# EAGLE design Lab (EAGLE 6.5.0)

## Sheet 1 of 2
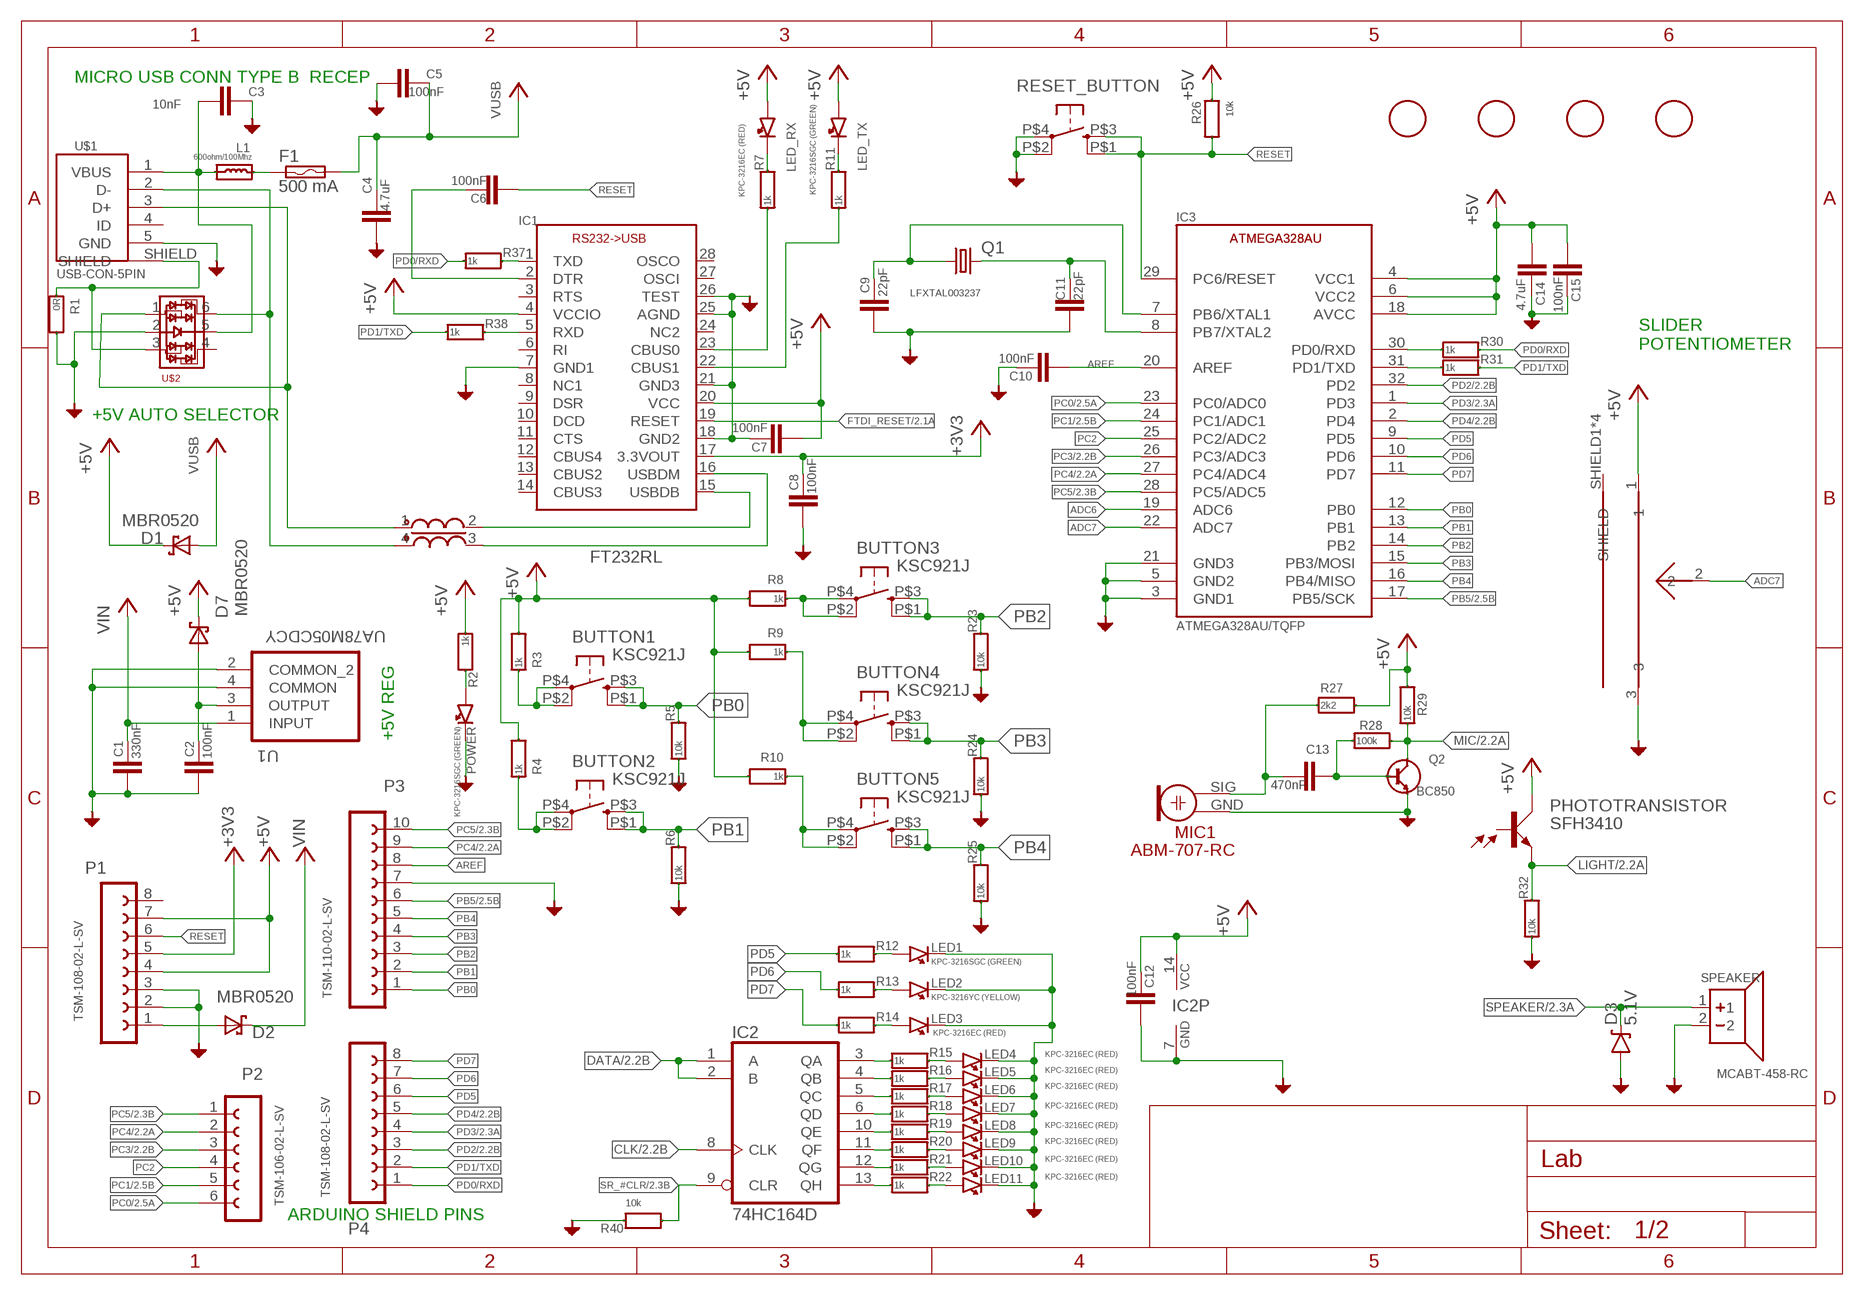
[diagram p0: schematic, sheet 1]

### Parts
BUTTON1  KSC921J  [TACT_SWITCH_4_PIN]
BUTTON2  KSC921J  [TACT_SWITCH_4_PIN]
BUTTON3  KSC921J  [TACT_SWITCH_4_PIN]
BUTTON4  KSC921J  [TACT_SWITCH_4_PIN]
BUTTON5  KSC921J  [TACT_SWITCH_4_PIN]
C1  330nF  C-EUC0805  [C0805]
C2  100nF  C-EUC0805  [C0805]
C3  10nF  C-EUC0805  [C0805]
C4  4.7uF  C-EUC0805  [C0805]
C5  100nF  C-EUC0805  [C0805]
C6  100nF  C-EUC0805  [C0805]
C7  100nF  C-EUC0805  [C0805]
C8  100nF  C-EUC0805  [C0805]
C9  22pF  C-EUC0805  [C0805]
C10  100nF  C-EUC0805  [C0805]
C11  22pF  C-EUC0805  [C0805]
C12  100nF  C-EUC0805  [C0805]
C13  470nF  C-EUC0805  [C0805]
C14  4.7uF  C-EUC0805  [C0805]
C15  100nF  C-EUC0805  [C0805]
D1  MBR0520  [SOD123]
D2  MBR0520  [SOD123]
D3  5.1V  DIODE-ZENER5.6V  [SOD-323]
D7  MBR0520  [SOD123]
F1  500 mA  POLYSWITCH  [PT1206]
IC1  FT232RL  [SSOP28]
IC2  74HC164D  [SO14]
IC3  ATMEGA328AU/TQFP  ATMEGA328AU  [TQFP32-08]
L1  600ohm/100Mhz  INDUCTOR_0603_600R  [R0603]
LED1  KPC-3216SGC (GREEN)  SMDLED_3216  [LED3216_PAC]
LED2  KPC-3216YC (YELLOW)  SMDLED_3216  [LED3216_PAC]
LED3  KPC-3216EC (RED)  SMDLED_3216  [LED3216_PAC]
LED4  KPC-3216EC (RED)  SMDLED_3216  [LED3216_PAC]
LED5  KPC-3216EC (RED)  SMDLED_3216  [LED3216_PAC]
LED6  KPC-3216EC (RED)  SMDLED_3216  [LED3216_PAC]
LED7  KPC-3216EC (RED)  SMDLED_3216  [LED3216_PAC]
LED8  KPC-3216EC (RED)  SMDLED_3216  [LED3216_PAC]
LED9  KPC-3216EC (RED)  SMDLED_3216  [LED3216_PAC]
LED10  KPC-3216EC (RED)  SMDLED_3216  [LED3216_PAC]
LED11  KPC-3216EC (RED)  SMDLED_3216  [LED3216_PAC]
LED_RX  KPC-3216EC (RED)  SMDLED_3216  [LED3216_PAC]
LED_TX  KPC-3216SGC (GREEN)  SMDLED_3216  [LED3216_PAC]
MIC1  ABM-707-RC  [ABM-707-RC]
P1  TSM-108-02-L-SV  FE08-1  [FE08]
P2  TSM-106-02-L-SV  FE06-1  [FE06]
P3  TSM-110-02-L-SV  FE10-1  [FE10]
P4  TSM-108-02-L-SV  FE08-1  [FE08]
PHOTOTRANSISTOR  SFH3410SMD  [SFH3410]
POWER  KPC-3216SGC (GREEN)  SMDLED_3216  [LED3216_PAC]
Q1  LFXTAL003237  CRYSTALSM49  [SM49]
Q2  BC850  [MY_SOT23]
R1  0R  MYRES_0805  [R0805]
R2  1k  MYRES_0805  [R0805]
R3  1k  MYRES_0805  [R0805]
R4  1k  MYRES_0805  [R0805]
R5  10k  MYRES_0805  [R0805]
R6  10k  MYRES_0805  [R0805]
R7  1k  MYRES_0805  [R0805]
R8  1k  MYRES_0805  [R0805]
R9  1k  MYRES_0805  [R0805]
R10  1k  MYRES_0805  [R0805]
R11  1k  MYRES_0805  [R0805]
R12  1k  MYRES_0805  [R0805]
R13  1k  MYRES_0805  [R0805]
R14  1k  MYRES_0805  [R0805]
R15  1k  MYRES_0805  [R0805]
R16  1k  MYRES_0805  [R0805]
R17  1k  MYRES_0805  [R0805]
R18  1k  MYRES_0805  [R0805]
R19  1k  MYRES_0805  [R0805]
R20  1k  MYRES_0805  [R0805]
R21  1k  MYRES_0805  [R0805]
R22  1k  MYRES_0805  [R0805]
R23  10k  MYRES_0805  [R0805]
R24  10k  MYRES_0805  [R0805]
R25  10k  MYRES_0805  [R0805]
R26  10k  MYRES_0805  [R0805]
R27  2k2  MYRES_0805  [R0805]
R28  100k  MYRES_0805  [R0805]
R29  10k  MYRES_0805  [R0805]
R30  1k  MYRES_0805  [R0805]
R31  1k  MYRES_0805  [R0805]
R32  10k  MYRES_0805  [R0805]
R37  1k  MYRES_0805  [R0805]
R38  1k  MYRES_0805  [R0805]
R40  10k  MYRES_0805  [R0805]
RESET_BUTTON  KSC921J  [TACT_SWITCH_4_PIN]
SLIDER_RESISTOR  PTA4543  [PTA4543]
SPEAKER  MCABT-458-RC  SMD_SPEAKER  [SMD_SPK_PAC]
U1  UA78M05CDCY  [SOT230P700X180-4N]
U$1  USB-CON-5PIN  [USB-MICRO-MOLEX-105017-0001_V2]
U$2  PRTR5V0U4Y  [SOT363]
U$3  FIDUCIAL  [FIDUCIAL_1MM]
U$4  FIDUCIAL  [FIDUCIAL_1MM]
U$5  FIDUCIAL  [FIDUCIAL_1MM]
U$6  FIDUCIAL  [FIDUCIAL_1MM]
USB_FILTER  SRF3216A  [SRF3216A]

### Nets
+3V3: C8.1 IC1.17(3.3VOUT) P1.5
+5V: C7.2 C12.2 C14.2 C15.2 D1.1(K) D7.1(K) IC1.4(VCCIO) IC1.20(VCC) IC2.14(VCC) IC3.4(VCC1) IC3.6(VCC2) IC3.18(AVCC) LED_RX.1 LED_TX.1 P1.4 P1.7 PHOTOTRANSISTOR.COLLECTOR R2.1 R3.2 R4.2 R8.2 R9.2 R10.2 R26.2 R27.2 R29.2 SLIDER_RESISTOR.1 ; also sheet 2
ADC6: IC3.19(ADC6)
ADC7: IC3.22(ADC7) SLIDER_RESISTOR.2
AREF: C10.2 IC3.20(AREF) P3.8
CLK: IC2.8(CLK) ; also sheet 2
DATA: IC2.1(A) IC2.2(B) ; also sheet 2
FTDI_RESET: IC1.19(RESET) ; also sheet 2
GND: C1.2 C2.2 C3.1 C4.2 C5.2 C7.1 C8.2 C9.2 C10.1 C11.2 C12.1 C14.1 C15.1 D3.A IC1.7(GND1) IC1.18(GND2) IC1.21(GND3) IC1.25(AGND) IC1.26(TEST) IC2.7(GND) IC3.3(GND1) IC3.5(GND2) IC3.21(GND3) LED1.2 LED2.2 LED3.2 LED4.2 LED5.2 LED6.2 LED7.2 LED8.2 LED9.2 LED10.2 LED11.2 MIC1.GND P1.2 P1.3 P3.7 POWER.2 Q2.2 R1.2 R5.1 R6.1 R23.1 R24.1 R25.1 R32.1 R40.2 RESET_BUTTON.P$2 RESET_BUTTON.P$4 SLIDER_RESISTOR.3 SPEAKER.2 U1.2(COMMON_2) U1.4(COMMON) U$1.5(GND) U$2.2 ; also sheet 2
LIGHT: PHOTOTRANSISTOR.EMITTER R32.2 ; also sheet 2
MIC: Q2.3 R28.2 R29.1 ; also sheet 2
N$1: C11.1 IC3.8(PB7/XTAL2) Q1.2
N$2: C9.1 IC3.7(PB6/XTAL1) Q1.1
N$3: LED5.1 R16.2
N$4: LED3.1 R14.2
N$6: LED2.1 R13.2
N$7: LED1.1 R12.2
N$8: LED4.1 R15.2
N$9: LED6.1 R17.2
N$10: LED7.1 R18.2
N$11: LED8.1 R19.2
N$12: LED9.1 R20.2
N$13: D2.2(A) P1.1
N$14: LED10.1 R21.2
N$15: IC1.23(CBUS0) R7.1
N$16: C6.1 IC1.2(DTR)
N$17: POWER.1 R2.2
N$18: IC1.15(USBDB) USB_FILTER.2
N$19: IC1.16(USBDM) USB_FILTER.3
N$20: LED11.1 R22.2
N$21: IC3.30(PD0/RXD) R30.1
N$22: IC2.3(QA) R15.1
N$23: IC2.4(QB) R16.1
N$25: IC2.5(QC) R17.1
N$28: LED_RX.2 R7.2
N$29: LED_TX.2 R11.2
N$30: IC1.22(CBUS1) R11.1
N$31: U$1.3(D+) U$2.1 USB_FILTER.1
N$32: IC3.31(PD1/TXD) R31.1
N$35: BUTTON1.P$2 BUTTON1.P$4 R3.1
N$37: BUTTON2.P$2 BUTTON2.P$4 R4.1
N$38: U$1.2(D-) U$2.6 USB_FILTER.4
N$40: BUTTON4.P$2 BUTTON4.P$4 R9.1
N$41: BUTTON5.P$2 BUTTON5.P$4 R10.1
N$42: BUTTON3.P$2 BUTTON3.P$4 R8.1
N$43: F1.1A F1.1B L1.1
N$44: IC1.5(RXD) R38.2
N$45: IC1.1(TXD) R37.2
N$46: C2.1 D7.2(A) U1.3(OUTPUT)
N$52: IC2.6(QD) R18.1
N$56: IC2.10(QE) R19.1
N$57: IC2.11(QF) R20.1
N$58: IC2.12(QG) R21.1
N$59: IC2.13(QH) R22.1
N$78: C13.1 Q2.1 R28.1
N$81: C13.2 MIC1.SIG R27.1
N$83: C3.2 L1.2 U$1.1(VBUS) U$2.5
PB0: BUTTON1.P$1 BUTTON1.P$3 IC3.12(PB0) P3.1 R5.2
PB1: BUTTON2.P$1 BUTTON2.P$3 IC3.13(PB1) P3.2 R6.2
PB2: BUTTON3.P$1 BUTTON3.P$3 IC3.14(PB2) P3.3 R23.2
PB3: BUTTON4.P$1 BUTTON4.P$3 IC3.15(PB3/MOSI) P3.4 R24.2
PB4: BUTTON5.P$1 BUTTON5.P$3 IC3.16(PB4/MISO) P3.5 R25.2
PB5: IC3.17(PB5/SCK) P3.6 ; also sheet 2
PC0: IC3.23(PC0/ADC0) P2.6 ; also sheet 2
PC1: IC3.24(PC1/ADC1) P2.5 ; also sheet 2
PC2: IC3.25(PC2/ADC2) P2.4
PC3: IC3.26(PC3/ADC3) P2.3 ; also sheet 2
PC4: IC3.27(PC4/ADC4) P2.2 P3.9 ; also sheet 2
PC5: IC3.28(PC5/ADC5) P2.1 P3.10 ; also sheet 2
PD0/RXD: P4.1 R30.2 R37.1
PD1/TXD: P4.2 R31.2 R38.1
PD2: IC3.32(PD2) P4.3 ; also sheet 2
PD3: IC3.1(PD3) P4.4 ; also sheet 2
PD4: IC3.2(PD4) P4.5 ; also sheet 2
PD5: IC3.9(PD5) P4.6 R12.1
PD6: IC3.10(PD6) P4.7 R13.1
PD7: IC3.11(PD7) P4.8 R14.1
RESET: C6.2 IC3.29(PC6/RESET) P1.6 R26.1 RESET_BUTTON.P$1 RESET_BUTTON.P$3
SHIELD1: R1.1 U$1.SHIELD U$2.3
SPEAKER: D3.C SPEAKER.1 ; also sheet 2
SR_#CLR: IC2.9(CLR) R40.1 ; also sheet 2
USB_VCC: C4.1 C5.1 D1.2(A) F1.2A F1.2B ; supply symbol labelled VUSB
VIN: C1.1 D2.1(K) U1.1(INPUT)
Unconnected: IC1.3(RTS) IC1.6(RI) IC1.8(NC1) IC1.9(DSR) IC1.10(DCD) IC1.11(CTS) IC1.12(CBUS4) IC1.13(CBUS2) IC1.14(CBUS3) IC1.24(NC2) IC1.27(OSCI) IC1.28(OSCO) P1.8 PHOTOTRANSISTOR.NC SLIDER_RESISTOR.SHIELD1(SHIELD) SLIDER_RESISTOR.SHIELD2(SHIELD) SLIDER_RESISTOR.SHIELD3(SHIELD) SLIDER_RESISTOR.SHIELD4(SHIELD) U$1.4(ID) U$2.4

### Notes on the sheet
- MICRO USB CONN TYPE B  RECEP
- SLIDER
  POTENTIOMETER
- +5V AUTO SELECTOR
- +5V REG
- ARDUINO SHIELD PINS

## Sheet 2 of 2
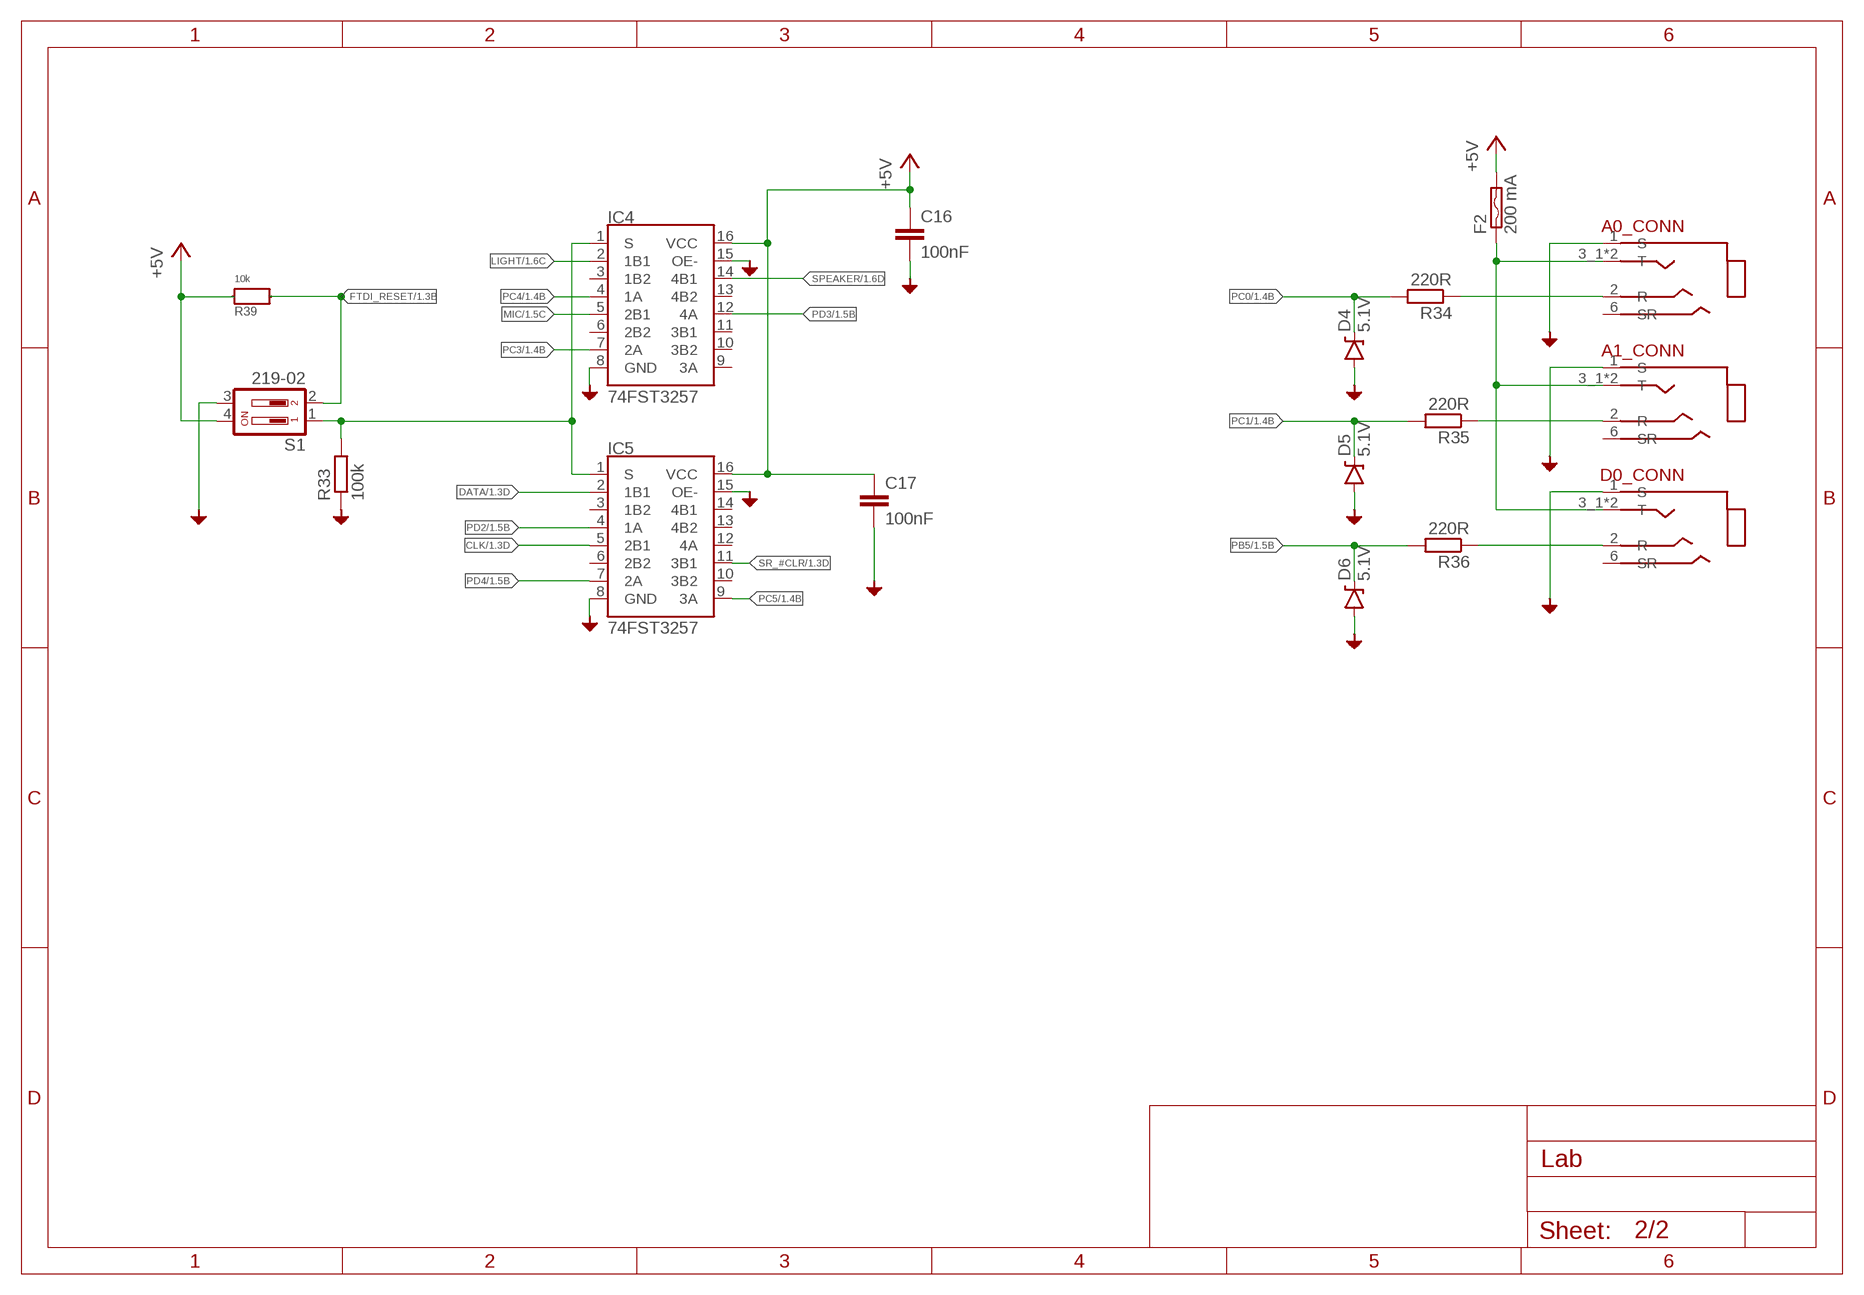
[diagram p1: schematic, sheet 2]

### Parts
A0_CONN  FC68125  [FC68125]
A1_CONN  FC68125  [FC68125]
C16  100nF  C-EUC0805  [C0805]
C17  100nF  C-EUC0805  [C0805]
D0_CONN  FC68125  [FC68125]
D4  5.1V  DIODE-ZENER5.6V  [SOD-323]
D5  5.1V  DIODE-ZENER5.6V  [SOD-323]
D6  5.1V  DIODE-ZENER5.6V  [SOD-323]
F2  200 mA  POLYSWITCH  [PT1206]
IC4  74FST3257  [SO16]
IC5  74FST3257  [SO16]
R33  100k  R-EU_R0805  [R0805]
R34  220R  R-EU_M0805  [M0805]
R35  220R  R-EU_M0805  [M0805]
R36  220R  R-EU_M0805  [M0805]
R39  10k  MYRES_0805  [R0805]
S1  219-02  [CTS-219-02]

### Nets
+5V: C16.1 C17.1 F2.2A F2.2B IC4.16(VCC) IC5.16(VCC) R39.2 S1.4 ; also sheet 1
+5V_FUSED: A0_CONN.3_1(T) A0_CONN.3_2(T) A1_CONN.3_1(T) A1_CONN.3_2(T) D0_CONN.3_1(T) D0_CONN.3_2(T) F2.1A F2.1B
CLK: IC5.5(2B1) ; also sheet 1
DATA: IC5.2(1B1) ; also sheet 1
FTDI_RESET: R39.1 S1.2 ; also sheet 1
GND: A0_CONN.1(S) A1_CONN.1(S) C16.2 C17.2 D0_CONN.1(S) D4.A D5.A D6.A IC4.8(GND) IC4.15(OE-) IC5.8(GND) IC5.15(OE-) R33.1 S1.3 ; also sheet 1
LIGHT: IC4.2(1B1) ; also sheet 1
MIC: IC4.5(2B1) ; also sheet 1
N$26: IC4.1(S) IC5.1(S) R33.2 S1.1
N$27: A1_CONN.2(R) R35.1
N$33: A0_CONN.2(R) R34.1
N$36: D0_CONN.2(R) R36.1
PB5: D6.C R36.2 ; also sheet 1
PC0: D4.C R34.2 ; also sheet 1
PC1: D5.C R35.2 ; also sheet 1
PC3: IC4.7(2A) ; also sheet 1
PC4: IC4.4(1A) ; also sheet 1
PC5: IC5.9(3A) ; also sheet 1
PD2: IC5.4(1A) ; also sheet 1
PD3: IC4.12(4A) ; also sheet 1
PD4: IC5.7(2A) ; also sheet 1
SPEAKER: IC4.14(4B1) ; also sheet 1
SR_#CLR: IC5.11(3B1) ; also sheet 1
Unconnected: A0_CONN.6(SR) A1_CONN.6(SR) D0_CONN.6(SR) IC4.3(1B2) IC4.6(2B2) IC4.9(3A) IC4.10(3B2) IC4.11(3B1) IC4.13(4B2) IC5.3(1B2) IC5.6(2B2) IC5.10(3B2) IC5.12(4A) IC5.13(4B2) IC5.14(4B1)

## Library data of the parts
A0_CONN A1_CONN D0_CONN = sduino:FC68125; MF: CLIFF ELECTRONIC COMPONENTS; MPN: FC68125; OC_FARNELL: 2309468
BUTTON1-BUTTON5 RESET_BUTTON = sduino:KSC921J: Tactile Switch; MF: C & K COMPONENTS; MPN: KSC921J LFS; OC_FARNELL: 2435155
C1 = rcl:C-EU: CAPACITOR, European symbol; MF: AVX; MPN: 08053C334KAT2A; OC_FARNELL: 1833878
C2 C5-C8 C10 C12 C15-C17 = rcl:C-EU: CAPACITOR, European symbol; MF: AVX; MPN: 08055C104KAT2A; OC_FARNELL: 499687
C3 = rcl:C-EU: CAPACITOR, European symbol; MF: MULTICOMP; MPN: MC0805B103K500CT; OC_FARNELL: 1759246
C4 C14 = rcl:C-EU: CAPACITOR, European symbol; MF: WALSIN; MPN: 0805X475K250CT; OC_FARNELL: 2497057
C9 C11 = rcl:C-EU: CAPACITOR, European symbol; MF: YAGEO (PHYCOMP); MPN: CC0805JRNPO9BN220; OC_FARNELL: 1362555
C13 = rcl:C-EU: CAPACITOR, European symbol; MF: MULTICOMP; MPN: MC0805F474Z250CT; OC_FARNELL: 1759175
D1 D2 D7 = sduino:MBR0520: Schottky diode; MF: FAIRCHILD SEMICONDUCTOR; MPN: MBR0520L; OC_FARNELL: 1467521
D3-D6 = SparkFun-DiscreteSemi:DIODE-ZENER: Zener Diode Production Part - 8199 3.4V Zener Voltage; MF: ON SEMICONDUCTOR; MPN: MM3Z5V1T1G; OC_FARNELL: 1431203; PROD_ID: DIO-12442; VALUE: 5.6V
F1 = sduino:POLYSWITCH: SMD PolySwitch; MF: TE CONNECTIVITY / RAYCHEM; MPN: NANOSMDC050F/13.2-2; OC_FARNELL: 1345942
F2 = sduino:POLYSWITCH: SMD PolySwitch; MF: TE CONNECTIVITY / RAYCHEM; MPN: NANOSMDC020F-2; OC_FARNELL: 1345939
IC1 = maxim:FT232RL; MF: FTDI; MPN: FT232RL-REEL; OC_FARNELL: 1146032
IC2 = 74xx-eu:74*164: 8-bit parallel out SHIFT REGISTER; MF: NXP; MPN: 74HC164D; OC_FARNELL: 1085337
IC3 = atmel:ATMEGA328AU; MF: ATMEL; MPN: ATMEGA328P-AU; OC_FARNELL: 1715486
IC4 IC5 = MyLibrary1:74FST3257; MF: ON SEMICONDUCTOR; MPN: 74FST3257DR2G; OC_FARNELL: 2464460
L1 = MyLibrary1:INDUCTOR_0603_600R; MF: WURTH ELEKTRONIK; MPN: 742792651; OC_FARNELL: 1635706
LED1 LED_TX POWER = MyLibrary1:SMDLED_3216; MF: KINGBRIGHT; MPN: KPC-3216SGC; OC_FARNELL: 1318254
LED2 = MyLibrary1:SMDLED_3216; MF: KINGBRIGHT; MPN: KPC-3216YC; OC_FARNELL: 1318264RL
LED3-LED11 LED_RX = MyLibrary1:SMDLED_3216; MF: KINGBRIGHT; MPN: KPC-3216EC; OC_FARNELL: 1318250RL
MIC1 = sduino:ABM-707-RC; MF: PRO SIGNAL; MPN: ABM-707-RC; OC_FARNELL: 1736563
P1 P4 = con-lsta:FE08-1: FEMALE HEADER; MF: MULTICOMP; MPN: 2212S-08SG-85; OC_FARNELL: 1593463; OC_NEWARK: unknown
P2 = con-lsta:FE06-1: FEMALE HEADER; MF: MULTICOMP; MPN: 2212S-06SG-85; OC_FARNELL: 1593462; OC_NEWARK: unknown
P3 = con-lsta:FE10-1: FEMALE HEADER; MF: MULTICOMP; MPN: 2212S-10SG-85; OC_FARNELL: 1593464; OC_NEWARK: unknown
PHOTOTRANSISTOR = sduino:SFH3410: Silicon NPN Phototransistor; MF: OSRAM; MPN: SFH3410-Z; OC_FARNELL: 1226438
Q1 = crystal:CRYSTAL: CRYSTAL; MF: IQD FREQUENCY PRODUCTS; MPN: LFXTAL003237; OC_FARNELL: 9713808; OC_NEWARK: unknown
Q2 = MyLibrary1:BC850; MF: NXP; MPN: BC850C,215; OC_FARNELL: 1081241
R1 = rcl:MYRES_0805; MF: MULTICOMP; MPN: MC01W08050R; OC_FARNELL: 9333681
R2-R4 R7-R22 R30 R31 R37 R38 = rcl:MYRES_0805; MF: VISHAY DRALORIC; MPN: CRCW08051K00FKTA; OC_FARNELL: 1652936
R5 R6 R23-R26 R29 R32 R39 R40 = rcl:MYRES_0805; MF: YAGEO (PHYCOMP); MPN: RC0805FR-0710KL; OC_FARNELL: 9237755
R27 = rcl:MYRES_0805; MF: YAGEO (PHYCOMP); MPN: RC0805FR-072K2L.; OC_FARNELL: 9237534
R28 = rcl:MYRES_0805; MF: YAGEO (PHYCOMP); MPN: RC0805FR-07100KL; OC_FARNELL: 9237879
R33 = rcl:R-EU_: RESISTOR, European symbol; MF: YAGEO (PHYCOMP); MPN: RC0805FR-07100KL; OC_FARNELL: 9237879
R34-R36 = rcl:R-EU_: RESISTOR, European symbol; MF: MULTICOMP; MPN: MCWR08X2200FTL; OC_FARNELL: 2447606
S1 = switch-dil:219-02*: Surface Mount DIP Switch Series 219 SMT CTS Electronic Components Sourc: www.ctscorp.com; MF: MULTICOMP; MPN: MCEMR-02-T; OC_FARNELL: 1524005; OC_NEWARK: unknown
SLIDER_RESISTOR = sduino:PTA4543; MF: BOURNS; MPN: PTA4543-2015DPB103; OC_FARNELL: 1688415
SPEAKER = MyLibrary1:SMD_SPEAKER; MF: MULTICOMP; MPN: MCABT-458-RC; OC_FARNELL: 2433031
U1 = sduino:UA78M05CDCY: IC, LINEAR VOLT REGULATOR, 5V; MF: TEXAS INSTRUMENTS; MPN: UA78M05CDCY; OC_FARNELL: 2296030; OC_NEWARK: 77C1885; PACKAGE: SOT-223-3; SUPPLIER: TEXAS INSTRUMENTS
U$1 = sduino:USB-CON-5PIN: Molex Micro USB 105017-0001; MF: MOLEX; MPN: 105017-0001; OC_FARNELL: 2293836
U$2 = sduino:PRTR5V0U4Y; MF: NXP; MPN: PRTR5V0U4Y,125; OC_FARNELL: 1757870
U$3-U$6 = adafruit:FIDUCIAL: For use by pick and place machines to calibrate the vision/machine, 1mm By microbuilder.eu
USB_FILTER = sduino:SRF3216A; MF: BOURNS; MPN: SRF3216A-900Y; OC_FARNELL: 2493828

## Board
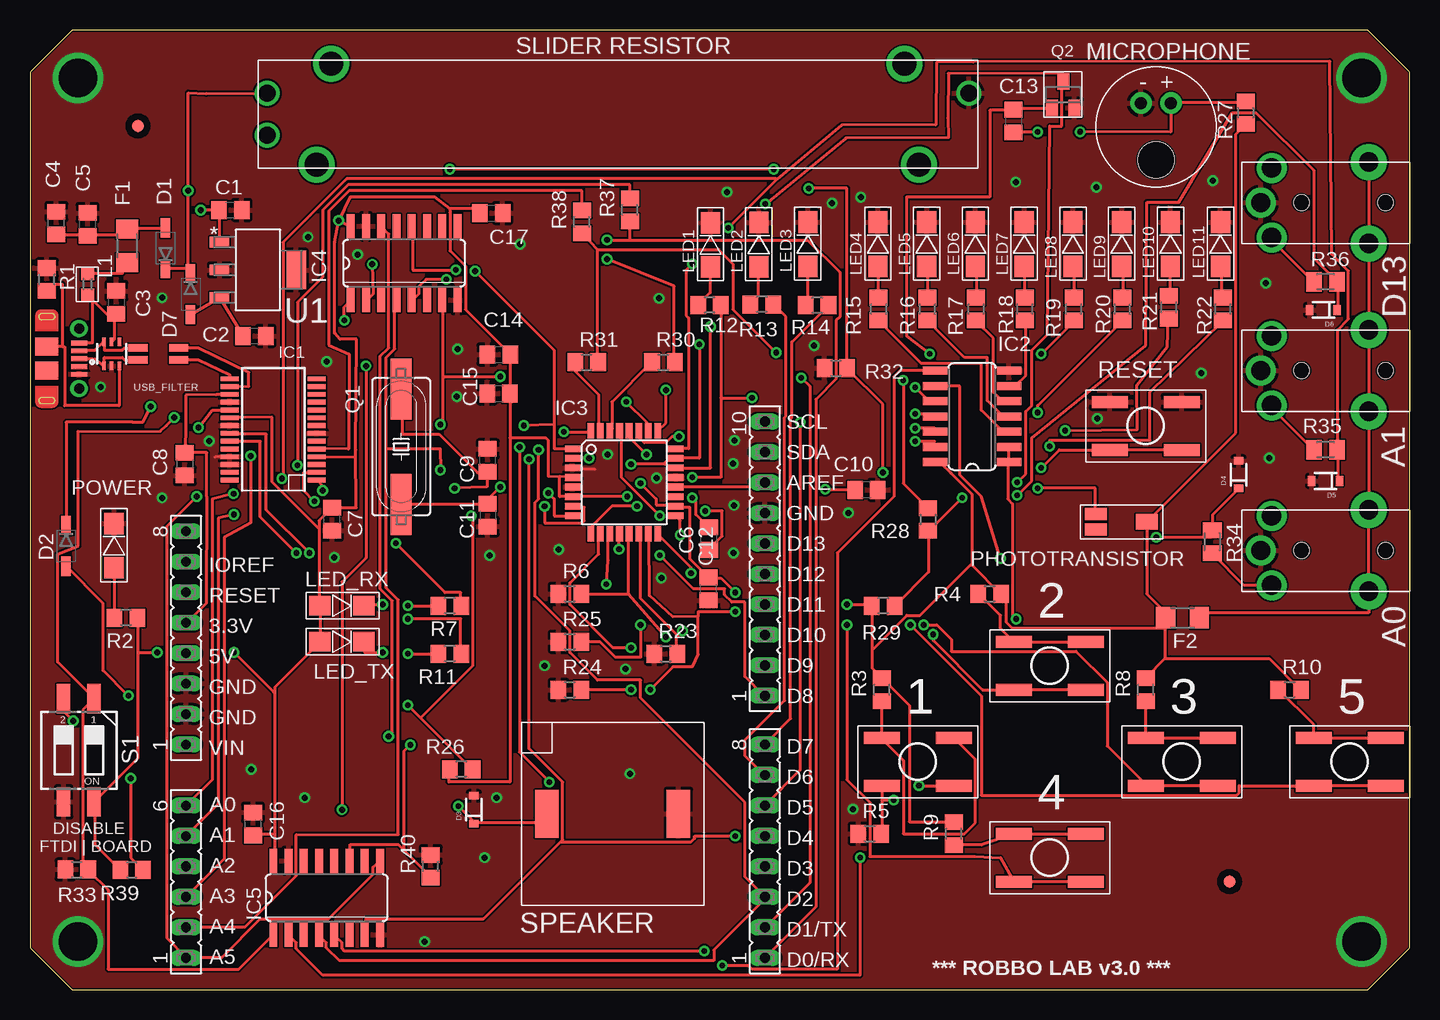
[diagram p2: board, top side]
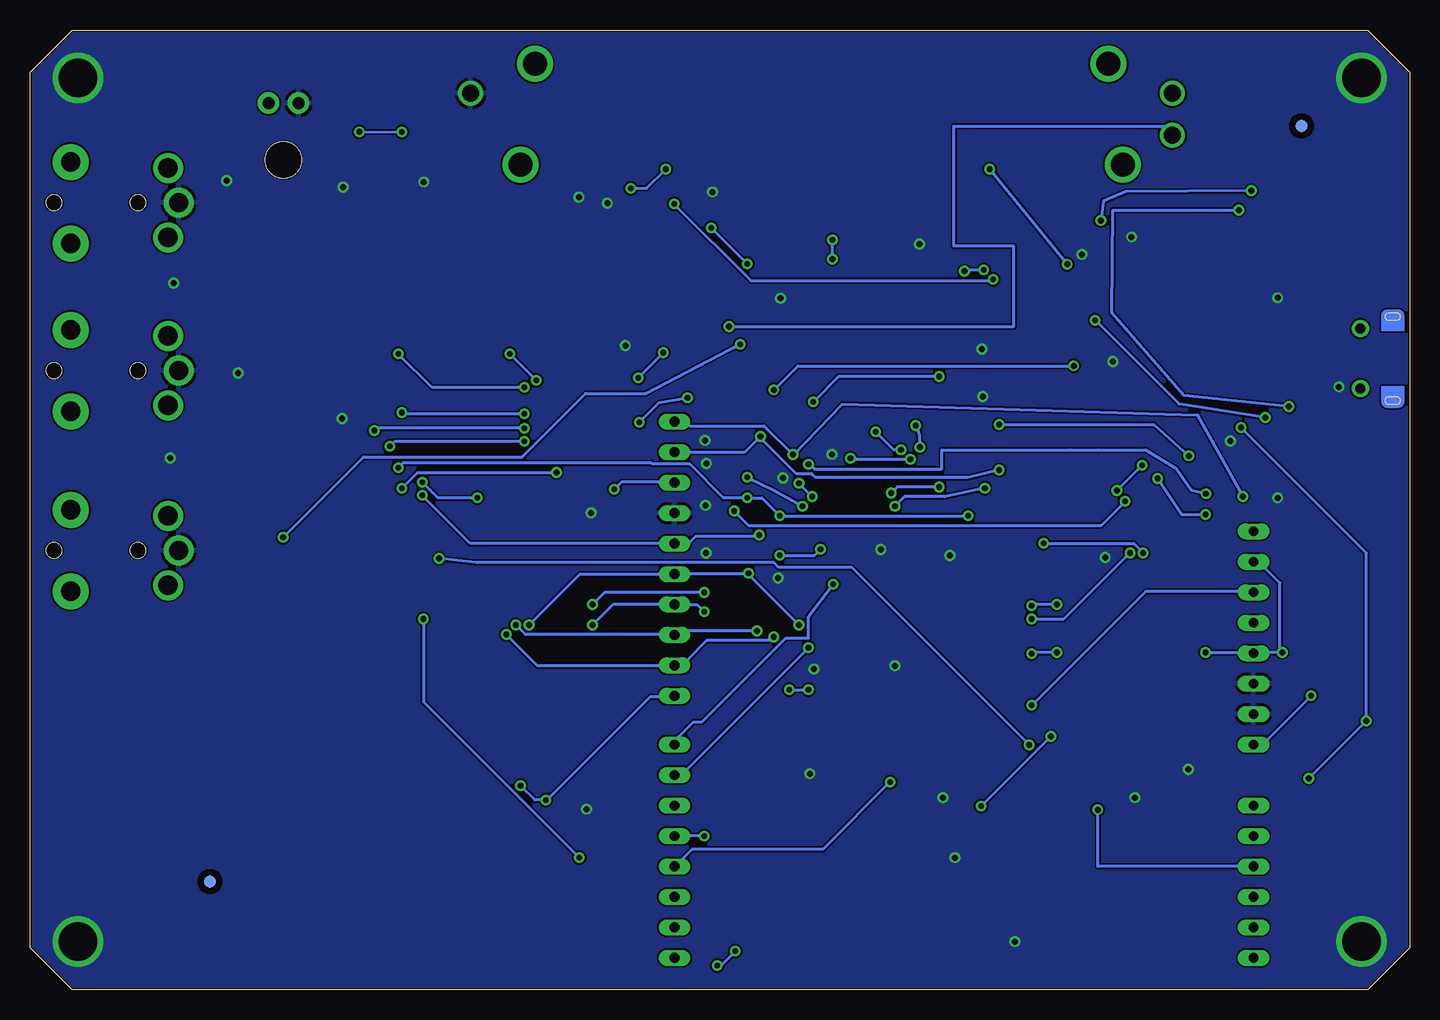
[diagram p3: board, bottom side, seen from below]

Size 115 x 80 mm. Coordinates in mm from the lower left corner, seen from the top.
Outline: 0,3.5 3.5,0 111.5,0 115,3.5 115,76.5 111.5,80 3.5,80 0,76.5 0,3.5
Copper layers (1*16): Top 0.035mm / dielectric 1.5mm / Bottom 0.035mm
Design rules "default *": minimum track width 10mil, minimum drill 19mil, track to track 6mil, track to pad 6mil, pad to pad 6mil, via to via 8mil, smd to smd 8mil, copper to edge 6mil, drill to drill 8mil, minimum pad ring 10mil, minimum via ring 8mil, stop-mask expansion 4mil, vias tented up to drill 0.6mm, thermal gap 10mil
Holes 3 mm at 93.87,69.17

### Footprints (pad centres in the part's own frame; a part is rotated, then mirrored left to right if it is on the bottom)
FC68125 = drill 1.6 pad 2.5: 1 12.4,3.4; 2 11.5,6.3; 6 11.5,0.5 | drill 1.6 pad 3: 3_1 3.4,6.8; 3_2 3.4,0 | hole 1.3: 2,3.4; 9,3.4
TACT_SWITCH_4_PIN = smd 3 x 1: P$1 3,-2; P$2 3,2; P$3 -3,-2; P$4 -3,2
C0805 = smd 1.3 x 1.5: 1 -0.95,0; 2 0.95,0
SOD123 = smd 1.6 x 0.8: 1 -1.7,0; 2 1.7,0
SOD-323 = smd 0.63 x 0.83: A 1.15,0; C -1.15,0
PT1206 = smd 1.6 x 1: 1A -1.4,-0.4; 1B -1.4,0.4; 2A 1.4,-0.4; 2B 1.4,0.4
SSOP28 = smd 0.4 x 1.5: 1 -4.225,-3.625; 2 -3.575,-3.625; 3 -2.925,-3.625; 4 -2.275,-3.625; 5 -1.625,-3.625; 6 -0.975,-3.625; 7 -0.325,-3.625; 8 0.325,-3.625; 9 0.975,-3.625; 10 1.625,-3.625; 11 2.275,-3.625; 12 2.925,-3.625; 13 3.575,-3.625; 14 4.225,-3.625; 15 4.225,3.625; 16 3.575,3.625; 17 2.925,3.625; 18 2.275,3.625; 19 1.625,3.625; 20 0.975,3.625; 21 0.325,3.625; 22 -0.325,3.625; 23 -0.975,3.625; 24 -1.625,3.625; 25 -2.275,3.625; 26 -2.925,3.625; 27 -3.575,3.625; 28 -4.225,3.625
SO14 = smd 0.66 x 2.032: 1 -3.81,-3.073; 2 -2.54,-3.073; 3 -1.27,-3.073; 4 0,-3.073; 5 1.27,-3.073; 6 2.54,-3.073; 7 3.81,-3.073; 8 3.81,3.073; 9 2.54,3.073; 10 1.27,3.073; 11 0,3.073; 12 -1.27,3.073; 13 -2.54,3.073; 14 -3.81,3.073
TQFP32-08 = smd 1.27 x 0.559: 1 -4.293,2.8; 2 -4.293,2; 3 -4.293,1.2; 4 -4.293,0.4; 5 -4.293,-0.4; 6 -4.293,-1.2; 7 -4.293,-2; 8 -4.293,-2.8; 17 4.293,-2.8; 18 4.293,-2; 19 4.293,-1.2; 20 4.293,-0.4; 21 4.293,0.4; 22 4.293,1.2; 23 4.293,2; 24 4.293,2.8 | smd 0.559 x 1.27: 9 -2.8,-4.293; 10 -2,-4.293; 11 -1.2,-4.293; 12 -0.4,-4.293; 13 0.4,-4.293; 14 1.2,-4.293; 15 2,-4.293; 16 2.8,-4.293; 25 2.8,4.293; 26 2,4.293; 27 1.2,4.293; 28 0.4,4.293; 29 -0.4,4.293; 30 -1.2,4.293; 31 -2,4.293; 32 -2.8,4.293
SO16 = smd 0.66 x 2.032: 1 -4.445,-3.073; 2 -3.175,-3.073; 3 -1.905,-3.073; 4 -0.635,-3.073; 5 0.635,-3.073; 6 1.905,-3.073; 7 3.175,-3.073; 8 4.445,-3.073; 9 4.445,3.073; 10 3.175,3.073; 11 1.905,3.073; 12 0.635,3.073; 13 -0.635,3.073; 14 -1.905,3.073; 15 -3.175,3.073; 16 -4.445,3.073
R0603 = smd 1 x 1.1: 1 -0.85,0; 2 0.85,0
LED3216_PAC = smd 1.8 x 1.6: 1 -1.84,0; 2 1.84,0
ABM-707-RC = drill 1 pad 1.8: GND -1.25,2; SIG 1.25,2
FE08 = drill 0.813 long: 1 -8.89,0; 2 -6.35,0; 3 -3.81,0; 4 -1.27,0; 5 1.27,0; 6 3.81,0; 7 6.35,0; 8 8.89,0
FE06 = drill 0.813 long: 1 -6.35,0; 2 -3.81,0; 3 -1.27,0; 4 1.27,0; 5 3.81,0; 6 6.35,0
FE10 = drill 0.813 long: 1 -11.43,0; 2 -8.89,0; 3 -6.35,0; 4 -3.81,0; 5 -1.27,0; 6 1.27,0; 7 3.81,0; 8 6.35,0; 9 8.89,0; 10 11.43,0
SFH3410 = smd 1.8 x 1.3: COLLECTOR 0.9,0 | smd 1.8 x 1: EMITTER 5.15,-0.65; NC 5.15,0.65
SM49 = smd 5.08 x 1.778: 1 -4.826,0; 2 4.826,0
MY_SOT23 = smd 1 x 1.4: 1 -0.95,-1.1; 2 0.95,-1.1; 3 0,1.1
R0805 = smd 1.3 x 1.5: 1 -0.95,0; 2 0.95,0
M0805 = smd 1.3 x 1.6: 1 -0.95,0; 2 0.95,0
CTS-219-02 = smd 1.13 x 2.44: 1 -1.27,-4.3; 2 1.27,-4.3; 3 1.27,4.3; 4 -1.27,4.3
PTA4543 = drill 1.4: 1 -29.25,1.75; 2 -29.25,-1.75; 3 29.25,1.75 | drill 2: SHIELD1 -23.9,4.2; SHIELD2 -25.1,-4.2; SHIELD3 25.1,-4.2; SHIELD4 23.9,4.2
SMD_SPK_PAC = smd 1.958 x 4: 1 -5.48,0; 2 5.48,0
SOT230P700X180-4N = smd 1.626 x 0.889: 1 -3.2,2.311; 2 -3.2,0; 3 -3.2,-2.311 | smd 1.626 x 3.175: 4 3.2,0
USB-MICRO-MOLEX-105017-0001_V2 = smd 0.4 x 1.35: 1 1.2,0; 2 1.85,0; 3 2.5,0; 4 3.15,0; 5 3.8,0 | drill 0.85 pad 1.45: P$1 0,0; P$2 5,0 | smd 1.5 x 1.9: P$3 3.5,-2.7; SHIELD 1.5,-2.7
SOT363 = smd 0.3 x 0.7: 1 -0.65,-1; 2 0,-1; 3 0.65,-1; 4 0.65,1; 5 0,1; 6 -0.65,1
FIDUCIAL_1MM = smd 1 x 1: 1 0,0
SRF3216A = smd 1.6 x 0.6: 1 -0.3,0; 2 3.1,0; 3 3.1,1; 4 -0.3,1

### Placement (x,y rotation side)
A0_CONN  115,40 180 top
A1_CONN  115,55 180 top
BUTTON1  74,19 0 top
BUTTON2  85,27 0 top
BUTTON3  96,19 0 top
BUTTON4  85,11 0 top
BUTTON5  110,19 0 top
C1  16.7,65 0 top
C2  18.7,54.5 0 top
C3  7.2,57.3 270 top
C4  2.2,63.9 90 top
C5  4.8,63.8 90 top
C6  56.6,37.6 90 top
C7  25.19,39.2 90 top
C8  12.9,43.81 270 top
C9  38.17,44.13 90 top
C10  69.73,41.65 180 top
C11  38.17,39.55 270 top
C12  56.56,33.41 90 top
C13  81.97,72.4 270 top
C14  39.08,52.95 0 top
C15  39.06,49.7 0 top
C16  18.6,13.8 90 top
C17  38.46,64.73 0 top
D0_CONN  115,69 180 top
D1  11.3,61.8 90 top
D2  3,37 270 top
D3  37,15 90 top
D4  100.75,42.93 90 top
D5  108,42.4 180 top
D6  107.82,56.66 180 top
D7  13.38,57.98 270 top
F1  8.1,62 90 top
F2  96.07,31 180 top
IC1  20.29,46.7 90 top
IC2  78.54,47.78 90 top
IC3  49.54,42.29 0 top
IC4  31.19,60.56 0 top
IC5  24.73,7.65 0 top
L1  4.8,58.8 270 top
LED1  56.73,62.09 90 top
LED2  60.76,62.1 90 top
LED3  64.84,62.14 90 top
LED4  70.69,62.14 90 top
LED5  74.75,62.14 90 top
LED6  78.81,62.14 90 top
LED7  82.88,62.14 90 top
LED8  86.94,62.14 90 top
LED9  91.01,62.14 90 top
LED10  95.07,62.14 90 top
LED11  99.24,62.14 90 top
LED_RX  26,32 0 top
LED_TX  26,29 0 top
MIC1  93.86,71.9 0 top
P1  13,29.31 90 top
P2  13,8.99 90 top
P3  61.26,35.92 90 top
P4  61.26,11.53 90 top
PHOTOTRANSISTOR  94,39 180 top
POWER  7,37 90 top
Q1  30.94,45.25 270 top
Q2  86.13,74.61 0 top
R1  1.4,59.2 90 top
R2  8,31 180 top
R3  71,25 90 top
R4  80,33 0 top
R5  70,13 0 top
R6  45,33 0 top
R7  35,32 180 top
R8  93,25 90 top
R9  77,13 90 top
R10  105,25 0 top
R11  35,28 180 top
R12  56.65,57.07 180 top
R13  61,57.12 180 top
R14  65.61,57.05 180 top
R15  70.75,56.73 90 top
R16  74.81,56.73 90 top
R17  78.87,56.73 90 top
R18  82.94,56.73 90 top
R19  87,56.73 90 top
R20  91.07,56.73 90 top
R21  94.93,56.89 90 top
R22  99.45,56.73 90 top
R23  53,28 0 top
R24  45,25 0 top
R25  45,29 0 top
R26  35.95,18.37 180 top
R27  101.34,73.1 270 top
R28  74.86,39.19 270 top
R29  71.12,31.99 180 top
R30  52.8,52.3 0 top
R31  46.4,52.3 0 top
R32  67.19,51.8 0 top
R33  3.9,10 0 top
R34  98.55,37.34 90 top
R35  108,45 0 top
R36  108,59 0 top
R37  50,65 90 top
R38  46,64 90 top
R39  8.48,9.96 180 top
R40  33.4,10.27 90 top
RESET_BUTTON  93,47 0 top
S1  4.07,19.94 180 top
SLIDER_RESISTOR  49.01,72.97 0 top
SPEAKER  48.58,14.65 0 top
U1  19,60 0 top
U$1  4.1,55.1 270 top
U$2  6.8,53 0 top
U$3  100,9 0 top
U$4  9,72 0 top
U$5  9,72 0 bottom
U$6  100,9 0 bottom
USB_FILTER  9.3,52.5 0 top

### Tracks (layer width: path | path; a pad name or v marks a point on that pad's centre or on a via)
+3V3
  Top 0.254: 13,44.8 C8.1 | IC1.17 16.6,49.6 15.9,49.6 15.51,49.59 12.99,49.56 12.99,46.4 C8.1 | P1.5 13.1,30.6 14.7,32.2 14.73,41.09 14.73,44.76 C8.1
+5V  (via drill 0.48, 0.5)
  Top 0.254: 78.5,35.4 80.9,33 R4.2 81,32.9 81.4,32.5 81.4,30.6 81.9,30.1 94.6,30.1 | 78.5,35.4 78.5,41.3 76.75,43.05 | 76.75,43.05 75.9,43.9 75.5,43.9 IC2.14 | 76.8,43.1 76.75,43.05 | 70.2,28.4 70.2,31.9 R29.2 70.1,32.1 v68.1,32.1 | 70.2,28.4 70.2,26.8 71,26 R3.2 71.1,25.9 73.3,23.7 73.3,14 77,14 R9.2 | 78.5,35.4 78.4,35.4 74.2,31.2 73.1,31.2 70.3,28.4 70.2,28.4 | 94.6,27.6 93,26 R8.2 | 94.6,30.1 94.6,30.6 F2.2B 94.7,30.7 94.7,31.4 F2.2A 94.6,31.5 93.1,33 PHOTOTRANSISTOR.COLLECTOR 100.5,46.4 100.5,71.3 101.3,72.1 R27.2 | 94.6,30.1 94.6,27.6 | 94.6,27.6 103.3,27.6 105.9,25 R10.2 | R26.2 34.9,18.3 34.9,17.3 40,17.3 40,46 | v49.8,41.1 45.3,41.1 | 45.9,42.6 45.3,42.6 IC3.4 45.2,42.8 44.15,42.79 | 45.3,41.1 IC3.6 | 44.15,42.79 43.2,42.8 43.2,45.8 43,46 40,46 | 40,46 40,48.9 40.1,48.9 40.1,49.6 C15.2 40,52.9 C14.2 40,53 36.3,56.7 36.3,60.3 35,61.6 35,64.8 34.97,65.11 | v50.9,42.2 52.2,40.9 52.2,40.4 53.8,40.4 IC3.18 53.9,40.2 55,40.2 55,35.9 56.5,34.4 C12.2 56.6,34.3 57.6,34.3 v58.8,33.1 | IC1.20 16.7,47.7 17.7,47.7 20.18,47.71 20.2,42.3 24,38.5 24.1,38.5 | 13.21,60.11 13.2,60.08 v13.2,66.6 13.2,74.76 14.7,74.7 SLIDER_RESISTOR.1 | 13.21,60.11 D1.1 | 9,28.1 9,19.3 5.4,15.7 S1.4 5.4,15.6 5.4,12.1 7.5,10 R39.2 | 9,28.1 9,31 R2.1 | 9,28.1 v10.6,28.1 | 20.4,24.8 20.4,25.2 24.1,28.9 LED_TX.1 24.2,29 24.2,32 LED_RX.1 24.1,32.1 24.1,38.5 | 20.4,24.8 20.4,13 | 20.4,13 20.4,10.9 20.3,10.8 IC5.16 | IC1.4 24,44.4 27.13,44.43 27.16,45.02 | 27.16,45.02 27.21,54.22 25.82,54.21 25.39,54.71 25.4,62.3 v25.73,64.12 | 24.1,38.5 24.1,39.1 25.1,40.1 C7.2 27.2,40.16 27.16,45.02 | v17,28.1 20.3,24.8 20.4,24.8
  Top 0.254: 34.97,65.11 33.7,66.1 26.7,66.1 v25.73,64.12 | 45.3,41.1 44.15,41.09 44.15,42.79 | C16.1 18.6,13 20.4,13 | C17.1 37.58,65.11 34.97,65.11 | D7.1 13.19,59.7 13.21,60.11 | v25.73,64.12 IC4.16
  Bottom 0.254: v49.8,41.1 v50.9,42.2 | P1.7 13,35.6 12.6,35.2 12.1,35.2 10.8,33.9 10.8,28.2 v10.6,28.1 13,28.1 P1.4 13.1,28.1 v17,28.1 | v68.1,32.1 67.1,33.1 v58.8,33.1 | v13.2,66.6 23.66,66.51 25.52,65.73 v25.73,64.12
+5V_FUSED
  Top 0.254: F2.1B 97.5,30.6 97.5,31.4 F2.1A 111.6,31.4 A0_CONN.3_1 A0_CONN.3_2 A1_CONN.3_1 A1_CONN.3_2 D0_CONN.3_1 D0_CONN.3_2
ADC7  (via drill 0.5)
  Top 0.254: IC3.22 56.73,43.49 v56.73,55.28 v56.73,55.29
  Bottom 0.254: v56.73,55.28 33,55.28 33,62 38,62 38,72 19.76,72 SLIDER_RESISTOR.2
AREF  (via drill 0.48)
  Top 0.254: IC3.20 53.9,41.9 61.2,41.9 61.2,42.2 P3.8 | v66.3,41.7 68.7,41.7 C10.2
  Bottom 0.254: v66.3,41.7 65.7,42.3 61.3,42.3 P3.8
CLK  (via drill 0.48)
  Top 0.254: v56.2,3.2 26.2,3.2 26,3.4 26,3.9 25.4,4.5 IC5.5 | v57.7,2 59.9,2 60.2,1.7 67.3,1.7 67.3,36.4 72,41.1 72,51.1 72.5,51.6 75.4,51.6 IC2.8
  Bottom 0.254: v56.2,3.2 57.4,2 v57.7,2
DATA  (via drill 0.48)
  Top 0.254: v69.2,11 69.2,1.2 24.4,1.2 22.2,3.4 22.2,3.9 21.6,4.5 IC5.2 | v82.2,30.9 81.9,31.2 81.9,40.5 81.5,40.9 81.5,43.8 81.6,43.9 IC2.1 81.6,44.1 81.6,45.2 IC2.2
  Bottom 0.254: v69.2,11 82.2,24 v82.2,30.9
FTDI_RESET  (via drill 0.48)
  Top 0.254: v8.4,17.6 8.4,11 9.4,10 R39.1 | v3.6,22.4 2.9,23.1 2.9,24.2 S1.2 | v14.05,46.86 15.2,48.3 16.6,48.3 IC1.19
  Bottom 0.254: v8.4,17.6 v3.6,22.4 3.6,36.4 v14.05,46.86
GND  (via drill 0.5, 3.2)
  Top 0.254: 4.1,51.2 U$1.5 | IC3.3 47.07,43.38 | IC1.25 15.42,44.39
  other vias: 4,76 4,4 111,4 111,76 50,18 68.59,15.04 11,41 35.58,49.45 35.65,53.41 24.74,52.35 25.37,36.02 44.08,36.69 42.9,27 49.64,26.71 38.3,36.18 48.16,44.62 58.72,45.79 68.24,39.75 65.37,53.68 58.62,43.85 58.68,40.37 58.65,36.39 52.22,42.65 52.63,34.32 97.65,51.41 103.3,44.31 103.03,58.89 98.59,67.43 88.91,66.9 82.17,67.33 69.25,66.05 66.87,65.57 58.09,66.5 88.99,47.6 38.9,16 37.9,11 32.9,4 22.9,16 23.17,62.75 27.31,61.29 14.93,45.72 18.44,18.36 40.85,62.16 52.44,57.63 11,57.67 5.88,50.25
  pour Bottom: -9,83 -9,-6 122,-6 122,84 -9,84
  pour Top: -5.5,83 -5.5,-3 118.5,-3 118.5,83.5 -5.5,83.5
LIGHT  (via drill 0.48)
  Top 0.254: v71.1,43.1 71.1,48.8 68.2,51.7 R32.2 68.1,51.9 68.1,66.8 v64.91,66.8 | v84,41.8 88.8,41.8 88.8,39.7 PHOTOTRANSISTOR.EMITTER | v28.53,60.47 28.6,58 28.1,57.5 IC4.2 | v62,68.4 v35,68.4
  Bottom 0.254: v71.1,43.1 82.7,43.1 v84,41.8 | v35,68.4 v28.53,60.47 | v62,68.4 63.6,66.8 v64.91,66.8
MIC  (via drill 0.48)
  Top 0.254: v82.3,42.3 83,43 83,48.2 83.5,48.7 83.5,53.3 84.8,54.6 85,72 86,72 86,75.6 86.1,75.7 Q2.3 86.1,75.8 86.1,76.36 76.56,76.38 76.52,72.68 76.58,71.04 68,71 v61.3,65.5 | v77.7,41 74.9,38.2 R28.2 74.9,38.1 74.9,34.8 72.1,32 R29.1 | v34.7,59.2 33,59.2 32.4,58.6 32.4,58 31.9,57.5 IC4.5
  Bottom 0.254: v82.3,42.3 81,41 v77.7,41 | v34.7,59.2 34.8,59.1 54.9,59.1 v61.3,65.5
N$1  (via drill 0.48)
  Top 0.254: v43.2,41.4 43.7,40.9 43.7,39.5 45.2,39.5 IC3.8 | v39.2,41.9 38.2,40.9 38.2,40.5 C11.1 38.1,40.5 31,40.5 Q1.2
  Bottom 0.254: v43.2,41.4 42.7,41.9 v39.2,41.9
N$2  (via drill 0.48)
  Top 0.254: v42.9,40.3 42.9,38.9 46,38.9 46.2,39.1 46.2,40.2 45.3,40.2 IC3.7 | v35.39,41.8 38.1,41.9 38.1,43.1 C9.1 38,43.1 37.3,43.1 34.1,46.3 31,46.3 31,50 Q1.1
  Bottom 0.254: v42.9,40.3 42.1,41.1 38.7,41.1 v35.39,41.8
N$3
  Top 0.254: R16.2 74.8,57.7 74.8,60.2 LED5.1
N$4
  Top 0.254: R14.2 64.7,57.1 64.8,57.2 64.8,60.2 LED3.1
N$6
  Top 0.254: R13.2 60.1,57.2 60.7,57.8 60.7,60.2 LED2.1
N$7
  Top 0.254: R12.2 55.7,57.1 56.7,58.1 56.7,60.2 LED1.1
N$8
  Top 0.254: R15.2 70.7,57.7 70.7,60.2 LED4.1
N$9
  Top 0.254: R17.2 78.9,57.7 78.9,60.2 LED6.1
N$10
  Top 0.254: R18.2 82.9,57.7 82.9,60.2 LED7.1
N$11
  Top 0.254: R19.2 87,57.7 87,60.2 LED8.1
N$12
  Top 0.254: R20.2 91.1,57.7 91.1,60.2 LED9.1
N$13  (via drill 0.48)
  Top 0.254: D2.2 6.1,32.2 6.1,26.6 v8.2,24.5
  Bottom 0.254: v8.2,24.5 12.2,20.5 13,20.5 P1.1
N$14
  Top 0.254: R21.2 95,57.9 95,60.2 LED10.1
N$15  (via drill 0.48)
  Top 0.254: v22.2,36.4 19.2,39.4 19.2,45.7 16.7,45.7 IC1.23 | v30.5,37.2 34.6,33.1 35.9,33.1 35.9,32 R7.1
  Bottom 0.254: v22.2,36.4 23,37.2 v30.5,37.2
N$16  (via drill 0.48)
  Top 0.254: v23.7,40.7 22.8,41.6 22.8,43.1 23.9,43.1 IC1.2 | v56.3,39.9 57.7,39.9 57.7,37.8 56.6,36.7 C6.1
  Bottom 0.254: v23.7,40.7 25.7,38.7 55.1,38.7 v56.3,39.9
N$17
  Top 0.254: POWER.1 7,31 R2.2
N$18
  Top 0.254: USB_FILTER.2 14,52.5 16.66,51.24 IC1.15
N$19
  Top 0.254: USB_FILTER.3 14,53.48 18.23,51.45 18.23,50.28 16.6,50.3 IC1.16
N$20
  Top 0.254: R22.2 99.4,57.7 99.3,57.8 99.3,60.2 LED11.1
N$21
  Top 0.254: IC3.30 48.4,46.6 48.5,46.7 48.5,49 51.8,52.3 R30.1
N$22
  Top 0.254: R15.1 70.8,55.7 74.3,52.2 79.3,52.2 79.3,48.3 81,46.6 81.6,46.6 IC2.3
N$23
  Top 0.254: R16.1 74.9,55.7 77.9,52.7 79.8,52.7 79.8,49.1 81.1,47.8 81.6,47.8 IC2.4
N$25
  Top 0.254: R17.1 78.9,55.7 80.3,54.3 80.3,49.8 81,49.1 81.6,49.1 IC2.5
N$26  (via drill 0.48)
  Top 0.254: IC5.1 20.2,4.5 17.4,1.7 6.5,1.7 6.5,8.3 4.9,9.9 R33.2 4.8,10.1 4.4,10.5 4.4,23.3 5.3,24.2 S1.1 5.3,24.3 2.3,27.3 2.3,36.3 4,37 4,46.54 10.86,46.56 11.37,47.01 v12.02,47.69 | v26.2,55.8 26.2,56.9 26.7,57.4 IC4.1
  Bottom 0.254: v26.2,55.8 19.2,48.8 v12.02,47.69
N$27
  Top 0.254: A1_CONN.2 103.5,48.5 107,45 R35.1
N$28  (via drill 0.48)
  Top 0.254: v31.5,32 R7.2 | v29.4,32.1 27.9,32.1 27.9,32 LED_RX.2
  Bottom 0.254: v31.5,32 31.4,32.1 v29.4,32.1
N$29  (via drill 0.48)
  Top 0.254: v31.5,28 R11.2 | v29.4,28.1 27.9,28.1 27.9,29 LED_TX.2
  Bottom 0.254: v31.5,28 31.4,28.1 v29.4,28.1
N$30  (via drill 0.48)
  Top 0.254: v23.3,36.4 19.7,40 19.7,46.3 16.7,46.3 IC1.22 | v31.5,30.9 35.9,30.9 35.9,28 R11.1
  Bottom 0.254: v23.3,36.4 28.8,30.9 v31.5,30.9
N$31
  Top 0.254: U$1.3 4.8,52.6 5.18,52.59 5.4,52.58 U$2.1 6.2,52.1 6.2,52.7 7.7,52.7 7.9,52.5 USB_FILTER.1
N$32
  Top 0.254: IC3.31 47.5,46.6 47.4,46.7 47.4,49.6 45.5,51.5 45.5,52.3 R31.1
N$33
  Top 0.254: A0_CONN.2 101.2,33.7 98.6,36.3 R34.1
N$35
  Top 0.254: R3.1 BUTTON1.P$4 71,20.9 72.8,19.1 72.8,13 77.9,13 78.8,13.9 78.8,19.2 BUTTON1.P$2
N$36
  Top 0.254: D0_CONN.2 103.5,62.5 107,59 R36.1
N$37
  Top 0.254: R4.1 79.1,33 80.9,31.2 80.9,30.1 BUTTON2.P$4 BUTTON2.P$2
N$38
  Top 0.254: U$1.2 4.1,53.3 5.4,53.3 6.1,54 U$2.6 6.2,53.9 6.2,53.3 7.7,53.3 7.9,53.5 USB_FILTER.4
N$40
  Top 0.254: R9.1 79.33,12.06 BUTTON4.P$4 BUTTON4.P$2
N$41
  Top 0.254: R10.1 104.1,25 107,22.1 BUTTON5.P$4 BUTTON5.P$2
N$42
  Top 0.254: R8.1 BUTTON3.P$4 BUTTON3.P$2
N$43
  Top 0.254: L1.1 4.8,59.7 7.7,59.7 F1.1B F1.1A
N$44
  Top 0.254: R38.2 46,66.6 26.6,66.6 24.9,64.9 24.9,53.73 26.59,52.99 26.55,45.06 24,45.1 IC1.5
N$45  (via drill 0.48)
  Top 0.254: v24.4,41.6 24.4,42 24,42.4 IC1.1 | v22.3,43.7 22.3,57.3 24.4,59.4 24.4,65 26.5,67.1 50,67.1 R37.2
  Bottom 0.254: v22.3,43.7 v24.4,41.6
N$46
  Top 0.254: D7.2 U1.3 C2.1
N$52
  Top 0.254: R18.1 83,55.7 83,51.2 82.2,50.4 81.7,50.4 IC2.6
N$56  (via drill 0.48)
  Top 0.254: v84.3,53 87,55.7 R19.1 | v73.8,50.2 74.9,49.1 75.4,49.1 IC2.10
  Bottom 0.254: v84.3,53 81.5,50.2 v73.8,50.2
N$57  (via drill 0.48)
  Top 0.254: v84,48.1 84,48.7 91,55.7 R20.1 | v73.8,48 75.4,48 75.4,47.8 IC2.11
  Bottom 0.254: v84,48.1 83.9,48 v73.8,48
N$58  (via drill 0.48)
  Top 0.254: v86.3,46.6 92.3,46.67 92.28,50.41 94.8,53.59 94.9,55.9 R21.1 | v73.8,46.8 75.4,46.8 75.4,46.6 IC2.12
  Bottom 0.254: v86.3,46.6 86.1,46.8 v73.8,46.8
N$59  (via drill 0.48)
  Top 0.254: v85,45.3 85,45.8 93.36,45.8 93.36,49.83 99.4,55.7 R22.1 | v73.8,45.7 75.4,45.7 75.4,45.3 IC2.13
  Bottom 0.254: v85,45.3 84.6,45.7 v73.8,45.7
N$78  (via drill 0.48)
  Top 0.254: Q2.1 85.1,73.5 82,73.5 82,73.4 C13.1 81.9,73.3 80.01,73.3 80.01,66.08 73.08,66.07 73.08,54.47 v75,53 | v72.8,50.8 72.8,42.2 74.8,40.2 R28.1
  Bottom 0.254: v75,53 v72.8,50.8
N$81  (via drill 0.48)
  Top 0.254: v84,71.5 82,71.5 C13.2 | v87.55,71.51 95.1,71.5 MIC1.SIG 95.1,74 101.3,74 R27.1
  Bottom 0.254: v87.55,71.51 v84,71.5
N$83
  Top 0.254: U$2.5 7,54.2 7,56.1 7.2,56.3 C3.2 6.9,55.8 5.25,57.45 | 5.25,57.45 4.8,57.9 L1.2 | U$1.1 5.2,53.9 5.2,57.4 5.25,57.45
PB0  (via drill 0.48)
  Top 0.254: BUTTON1.P$3 71,15.8 | 71,15.8 71,13 R5.2 | v74.1,17 BUTTON1.P$1 | 71,15.8 v72,15.8 | v49.1,36.7 49.1,37.9 IC3.12 | v52.5,36.2 55.3,33.4 57.9,33.4 57.9,32.9 58.5,32.3 59.6,32.3 59.6,26.1 61.2,24.5 P3.1
  Bottom 0.254: v74.1,17 72.9,15.8 v72,15.8 71.9,15.8 63.3,24.4 61.3,24.4 P3.1 | v49.1,36.7 49.6,36.2 v52.5,36.2
PB1  (via drill 0.48)
  Top 0.254: BUTTON2.P$1 BUTTON2.P$3 79.4,25 75.3,29.1 v75.3,29.6 | 49.9,32.99 46.5,33 R6.2 | 49.9,32.99 49.9,37.9 IC3.13 | 49.9,32.99 v53,29.4
  Bottom 0.254: v53,29.4 53.3,29.1 58.6,29.1 60.2,27.5 60.8,27.5 61.2,27.1 P3.2 61.3,27 72.7,27 v75.3,29.6
PB2  (via drill 0.48)
  Top 0.254: BUTTON3.P$1 BUTTON3.P$3 93,17.1 89.8,20.3 89.8,25.6 87.2,28.2 76.8,28.2 76.8,29.2 75.6,30.4 v74.5,30.4 | 53.9,29.5 53.9,28 R23.2 | 53.9,29.5 53.9,29.6 50.9,32.6 50.9,37.8 50.8,37.9 IC3.14 | v54.4,29.9 54,29.5 53.9,29.5
  Bottom 0.254: v54.4,29.9 60.9,29.9 61.2,29.6 P3.3 61.3,29.6 73.7,29.6 v74.5,30.4
PB3  (via drill 0.48)
  Top 0.254: BUTTON4.P$1 BUTTON4.P$3 80.9,11 78.8,11.1 70,11.1 70,15.6 68.1,17.5 v68.1,30.4 | 55.69,31.12 55.7,31.5 v58.8,31.5 | 55.69,31.12 53.59,31.07 51.64,32.84 51.6,37.9 IC3.15 | v50.1,25 R24.2 | v51.7,25 53.6,26.9 55.2,26.9 55.69,27.96 55.69,31.12
  Bottom 0.254: v58.8,31.5 59.4,32.1 61.2,32.1 P3.4 61.3,32.1 66.4,32.1 v68.1,30.4 | v51.7,25 v50.1,25
PB4  (via drill 0.48)
  Top 0.254: BUTTON5.P$1 BUTTON5.P$3 100.8,17 100.8,16.4 100.6,16.2 79.3,16.2 79.3,24.5 v73.4,30.4 | v55.1,34.7 55.1,35.2 52.4,37.9 IC3.16 | R25.2 47.5,29 48.8,27.7 50.9,27.7 v50.9,30.4
  Bottom 0.254: v50.9,30.4 55.1,34.6 v55.1,34.7 61.2,34.7 P3.5 61.3,34.6 69.2,34.6 v73.4,30.4
PB5  (via drill 0.48)
  Top 0.254: D6.C 109,56.7 109,59 R36.2 108.9,59.1 107,61 107,68.3 102.2,73.1 100.22,73.1 95.79,65.64 93.12,65.64 93.01,53.69 83.52,45.98 83.5,42.4 v82.3,41.2 | v54.2,37.9 54.2,39.1 53.9,39.4 IC3.17
  Bottom 0.254: v54.2,37.9 54.3,37.8 59.5,37.8 60.1,37.2 61.2,37.2 P3.6 61.3,37.2 78.3,37.2 v82.3,41.2
PC0  (via drill 0.48)
  Top 0.254: D4.C 100.7,41.7 98.6,39.6 98.6,38.3 R34.2 98.5,38.2 98.5,37.7 v93.9,37.7 | v55.8,53.8 55.8,44.3 53.9,44.3 IC3.23 53.8,44.2 53.2,44.2 52.9,43.9 52.9,43.8 v50.1,43.8 | v16.97,41.34 15.2,40.9 15.2,17.5 P2.6
  Bottom 0.254: v55.8,53.8 63.7,49.7 68.7,49.7 74,44.4 87.2,44.4 v93.9,37.7 | v16.97,41.34 18.19,41.63 19.45,43.42 22,45 25.93,45 28.27,44.98 39,45 39,43.4 49.6,43.4 50,43.8 v50.1,43.8
PC1  (via drill 0.48)
  Top 0.254: D5.C 109.1,42.4 109,42.5 109,45 R35.2 109,45.1 109,55 109.9,55.9 109.9,59.9 108.5,61.3 108.37,77.38 78.61,77.34 75.58,77.31 75.51,72.09 67.66,72.07 62.25,67.55 | v55.2,60.5 54.7,60 54.7,56.2 54.9,56 54.9,45.1 53.9,45.1 IC3.24 | 62.25,67.55 v58.2,63.5 | v17,39.6 15.7,39.3 15.7,15.5 P2.5 | v21,42.6 21.1,42.7 21.1,62.3 26.4,67.6 62.2,67.6 62.25,67.55
  Bottom 0.254: v58.2,63.5 v55.2,60.5 | v17,39.6 19,39.6 v21,42.6
PC2  (via drill 0.5)
  Top 0.254: IC3.25 53,47.24 v53,50 | v28,52 28,36 26,34 v26,15
  Bottom 0.254: P2.4 26,10.26 v26,15 | v53,50 51,52 v28,52
PC3  (via drill 0.48)
  Top 0.254: v49.7,49 51.4,47.3 51.4,46.7 51.5,46.6 IC3.26 | 34.4,51.1 v39.2,51.1 | 34.4,51.1 34.4,57.4 IC4.7 | v18.39,44.49 18.4,38.9 16.2,37.7 16.2,10.9 P2.3 | v34.2,47.1 34.4,47.3 34.4,51.1
  Bottom 0.254: v49.7,49 47.6,51.1 v39.2,51.1 | v18.39,44.49 21.3,47.1 v34.2,47.1
PC4  (via drill 0.48)
  Top 0.254: v54.1,46.1 53.5,46.1 53,45.6 51.2,45.6 50.9,45.9 50.9,46.4 50.8,46.5 IC3.27 | 29.7,45.1 29.7,33.5 30.7,32.5 30.7,12.92 22.2,12.9 22.2,9.5 17.9,5.2 P2.2 | 29.7,45.1 29.7,52.7 30.4,53.4 30.4,57.3 30.5,57.4 IC4.4 | v34.21,43.31 34.2,45.1 29.7,45.1
  Bottom 0.254: P3.9 61.2,44.8 55.4,44.8 v54.1,46.1 54.1,46 51.1,43 49.8,43 49.5,42.7 36.8,42.7 v34.21,43.31
PC5  (via drill 0.48)
  Top 0.254: v51.4,44.6 50.1,45.9 50.1,46.4 50,46.5 IC3.28 | v13.9,41.1 11.4,38.6 11.4,4.3 P2.1 13.1,2.7 16,2.7 19.2,5.9 24.9,5.9 28.6,9.6 28.6,10.2 29.1,10.7 IC5.9
  Bottom 0.254: P3.10 61.2,47.3 60.3,47.3 60,47 53.8,47 v51.4,44.6 51.3,44.6 47.29,48.81 17.7,47.9 v13.9,41.1
PD0/RXD  (via drill 0.48)
  Top 0.254: v48.1,60.9 53.7,58.63 53.7,52.3 R30.2 | v48.1,62.5 50,62.5 | 50,62.5 64.8,62.5 67.5,59.8 67.5,56.1 67.2,55.8 67.2,50.9 65.5,49.2 65.5,6.9 61.3,2.7 P4.1 | 50,62.5 R37.1
  Bottom 0.254: v48.1,60.9 v48.1,62.5
PD1/TXD  (via drill 0.48)
  Top 0.254: 47.3,61.7 47.3,52.3 R31.2 | v64.3,51 65,50.3 65,8.9 61.3,5.2 P4.2 | v62.2,53.1 58.6,56.7 58.6,60.5 57.4,61.7 47.3,61.7 | R38.1 47.3,61.7
  Bottom 0.254: v62.2,53.1 v64.3,51
PD2  (via drill 0.48)
  Top 0.254: v44.5,46.5 46.7,46.5 IC3.32 | v42.4,45 42.4,40.9 42.1,40.6 42.1,32.8 45,29.9 45,28.1 47.3,25.8 50.9,25.8 50.9,24.3 59.6,15.6 59.6,9.4 61.2,7.8 P4.3 61.3,7.6 57,3.3 57,2.4 25.8,2.4 24.7,3.5 24.7,3.9 24.1,4.5 IC5.4
  Bottom 0.254: v44.5,46.5 43,45 v42.4,45
PD3  (via drill 0.48)
  Top 0.254: 43.7,47.1 43.7,53.3 v37.1,59.9 | 43.7,47.1 43.7,45.1 45.2,45.1 IC3.1 | v35.5,60 31.9,60 31.9,63.6 IC4.12 | v43.3,17.3 40.8,19.8 40.8,45 v40.81,45.22 | 43.7,47.1 v41.16,47.02
  Bottom 0.254: v37.1,59.9 37,60 v35.5,60 | v43.3,17.3 48.9,11.7 59.8,11.7 61.2,10.3 P4.4 | v40.81,45.22 40.85,46.18 v41.16,47.02
PD4  (via drill 0.48)
  Top 0.254: v46.6,44.3 45.3,44.3 IC3.2 | v41.6,44.2 41.6,20.1 44.4,17.3 44.4,12.5 44.25,12.35 | 44.25,12.35 37.8,5.9 28,5.9 28,4.6 IC5.7 | v58.8,12.8 55.4,12.8 55.4,12.6 55.1,12.3 44.3,12.3 44.25,12.35
  Bottom 0.254: v46.6,44.3 46.5,44.2 v41.6,44.2 | v58.8,12.8 61.2,12.8 P4.5
PD5  (via drill 0.48)
  Top 0.254: v50.6,40.3 48.5,40.3 46.9,38.7 46.9,38.1 46.8,38 IC3.9 | v55.2,42.7 57.6,42.7 57.6,49.33 | 57.6,49.33 57.6,57 R12.1 | v64.2,47.3 64.2,18.3 61.3,15.4 P4.6 | 57.6,49.33 v60.19,49.33
  Bottom 0.254: v50.6,40.3 53.12,41.7 v55.2,42.7 | v64.2,47.3 62.6,48.9 v60.19,49.33
PD6  (via drill 0.48)
  Top 0.254: v50.1,28.5 48.6,28.5 45,32.1 45,33.9 47.4,36.3 47.4,37.8 47.5,37.9 IC3.10 | R13.1 62,57.1 63,56.1 63,47.8 62.9,47.7 62.9,24.1 59.6,20.8 59.6,19.5 61.2,17.9 P4.7
  Bottom 0.254: v50.1,28.5 60.7,17.9 61.2,17.9 P4.7
PD7  (via drill 0.48)
  Top 0.254: v48.05,33.79 48.2,35.8 48.2,37.8 48.3,37.9 IC3.11 | R14.1 66.5,57 63.5,54 63.5,47.7 63.4,47.6 63.4,22.6 61.3,20.5 P4.8
  Bottom 0.254: v48.05,33.79 50.1,31.1 50.1,29.3 52,29.3 59,22.3 59.7,22.3 61.2,20.8 61.2,20.5 P4.8
RESET  (via drill 0.48)
  Top 0.254: v31.5,23.7 32.55,22.65 | 32.55,22.65 36.8,18.4 R26.1 | RESET_BUTTON.P$1 RESET_BUTTON.P$3 85.8,45 v84.3,43.5 | v52.5,39.5 49.3,42.7 49.3,46.4 49.2,46.5 IC3.29 | v55.2,41 55.5,40.7 55.5,39.6 56.6,38.5 C6.2 | 32.55,22.65 36.9,27 36.9,39.4 v36.8,39.5
  Bottom 0.254: v31.5,23.7 22,33.2 13.1,33.2 P1.6 | v84.3,43.5 83.9,43.9 63.2,43.9 63.1,43.8 60,43.8 57.2,41 v55.2,41 54,41 v52.5,39.5 v36.8,39.5
SHIELD1
  Top 0.254: R1.1 1.4,58.8 2.7,58.8 2.7,53.6 | 2.7,53.6 U$1.SHIELD | 2.7,53.6 2.88,53.6 2.88,48.68 7.43,48.68 7.43,52 U$2.3
SPEAKER  (via drill 0.48)
  Top 0.254: SPEAKER.1 43.1,14.6 43.1,13.9 37,13.9 D3.C 37,14 v35.7,15.3 | v29.9,21.1 30.2,21.4 30.2,32.4 29.2,33.4 29.2,52.8 29.9,53.5 29.9,63 29.3,63.6 IC4.14
  Bottom 0.254: v35.7,15.3 v29.9,21.1
SR_#CLR  (via drill 0.48)
  Top 0.254: 31.15,11.65 30.7,12.1 26.7,12.1 26.7,10.8 IC5.11 | 31.15,11.65 33.4,9.4 R40.1 | v80.9,35.94 79.3,41.1 77.5,42.9 77.5,50.3 75.5,50.3 IC2.9 | v31.7,20.4 31.2,19.9 31.2,11.7 31.15,11.65
  Bottom 0.254: v80.9,35.94 77.8,35.6 53,35.6 52.6,35.2 46.5,35.2 v31.7,20.4
USB_VCC
  Top 0.254: C4.1 2.2,62.9 4.8,62.9 C5.1 4.9,62.9 7.6,62.9 7.6,63.4 F1.2B F1.2A 8.5,63.5 D1.2
VIN  (via drill 0.5)
  Top 0.254: C1.1 15.8,65 15.8,62.4 U1.1 | D2.1 3,47.3 8.56,47.3 9.43,47.32 v10.05,48.6 | 16.1,65.4 15.8,65.1 C1.1 | C1.1 v14.24,64.99
  Bottom 0.254: v10.05,48.6 18.82,49.54 24.8,56.39 24.72,64.97 v14.24,64.99

### Text on the board
tPlace: DISABLE / FTDI | BOARD | *** ROBBO LAB v3.0 ***
tNames: SLIDER RESISTOR | MICROPHONE | D13 | RESET | A1 | 2 | A0 | SCL / SDA / AREF / GND / D13 / D12 / D11 / D10 / D9 / D8 | 1 | 3 | 5 | IOREF / RESET / 3.3V / 5V / GND / GND / VIN | 4 | A0 / A1 / A2 / A3 / A4 / A5 | D7 / D6 / D5 / D4 / D3 / D2 / D1/TX / D0/RX